# EAGLE schematic Ceramic Resonator (EAGLE 8.1.0)
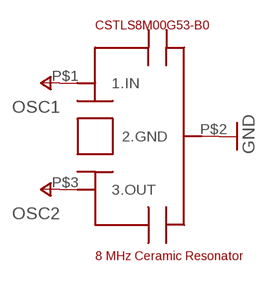
[diagram p0: schematic, sheet 1]

## Parts
CSTLS8M00G53-B0  8 MHz Ceramic Resonator  CSTLS8M00G53-B0  [CSTLS8M00G53-B0]

## Nets
GND: CSTLS8M00G53-B0.P$2(2.GND)
V+: CSTLS8M00G53-B0.P$1(1.IN) CSTLS8M00G53-B0.P$3(3.OUT) ; supply symbol labelled OSC1, OSC2

## Library data of the parts
CSTLS8M00G53-B0 = ME433:CSTLS8M00G53-B0